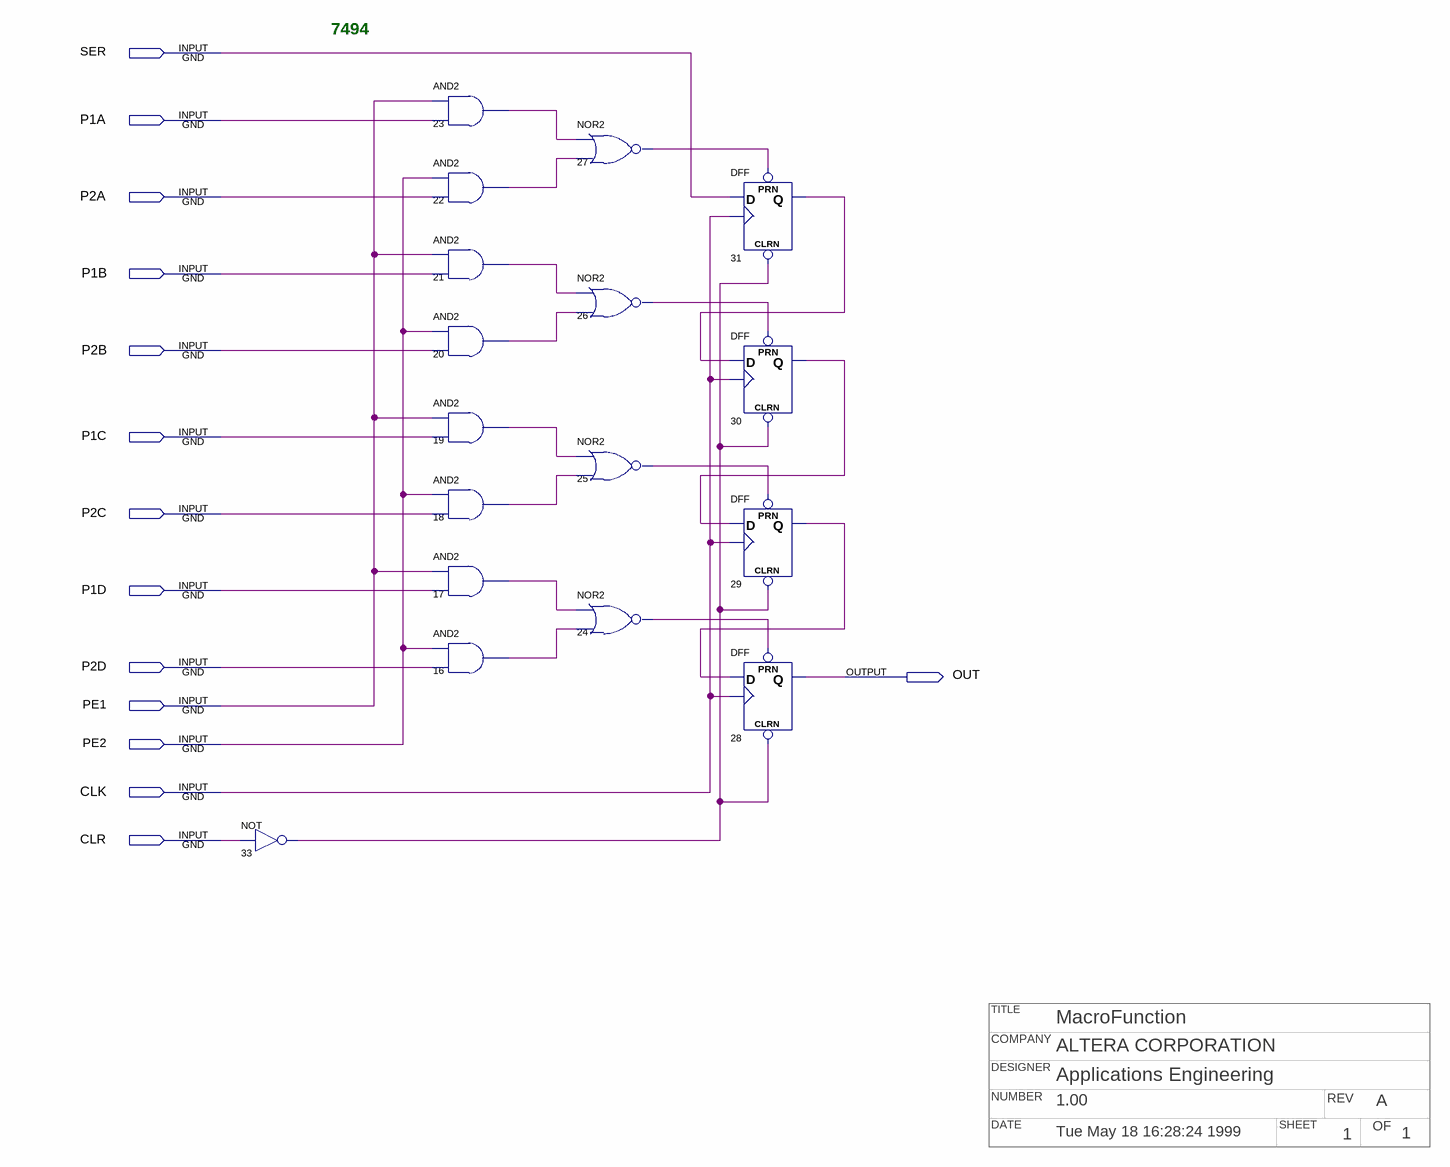
[diagram p0: schematic sheet]
// Quartus schematic 7494.bdf as structural Verilog: 17 symbols, 14 pins
// Title block: TITLE: MacroFunction; COMPANY: ALTERA CORPORATION; DESIGNER: Applications Engineering; NUMBER: 1.00; REV: A; DATE: Tue May 18 16:28:24 1999; SHEET: 1; OF: 1
module \7494  (
  input  SER,
  input  P1A,
  input  P2A,
  input  P1B,
  input  P2B,
  input  P1C,
  input  P2C,
  input  P1D,
  input  P2D,
  input  PE1,
  input  PE2,
  input  CLK,
  input  CLR,
  output OUT
);

  wire n16_out, n17_out, n18_out, n19_out, n20_out, n21_out, n22_out, n23_out, n24_out, n25_out, n26_out,
       n27_out, n29_q, n30_q, n31_q, n33_out;

  not u_33 (n33_out, CLR);
  and u_23 (n23_out, PE1, P1A);
  and u_22 (n22_out, PE2, P2A);
  and u_21 (n21_out, PE1, P1B);
  and u_20 (n20_out, PE2, P2B);
  and u_19 (n19_out, PE1, P1C);
  and u_18 (n18_out, PE2, P2C);
  and u_17 (n17_out, PE1, P1D);
  and u_16 (n16_out, PE2, P2D);
  nor u_27 (n27_out, n23_out, n22_out);
  nor u_26 (n26_out, n21_out, n20_out);
  nor u_25 (n25_out, n19_out, n18_out);
  nor u_24 (n24_out, n17_out, n16_out);
  DFF u_31 (.CLRN(n33_out), .CLK(CLK), .D(SER), .PRN(n27_out), .Q(n31_q));
  DFF u_30 (.CLRN(n33_out), .CLK(CLK), .D(n31_q), .PRN(n26_out), .Q(n30_q));
  DFF u_29 (.CLRN(n33_out), .CLK(CLK), .D(n30_q), .PRN(n25_out), .Q(n29_q));
  DFF u_28 (.CLRN(n33_out), .CLK(CLK), .D(n29_q), .PRN(n24_out), .Q(OUT));

  // Notes on the sheet:
  //   7494
endmodule
